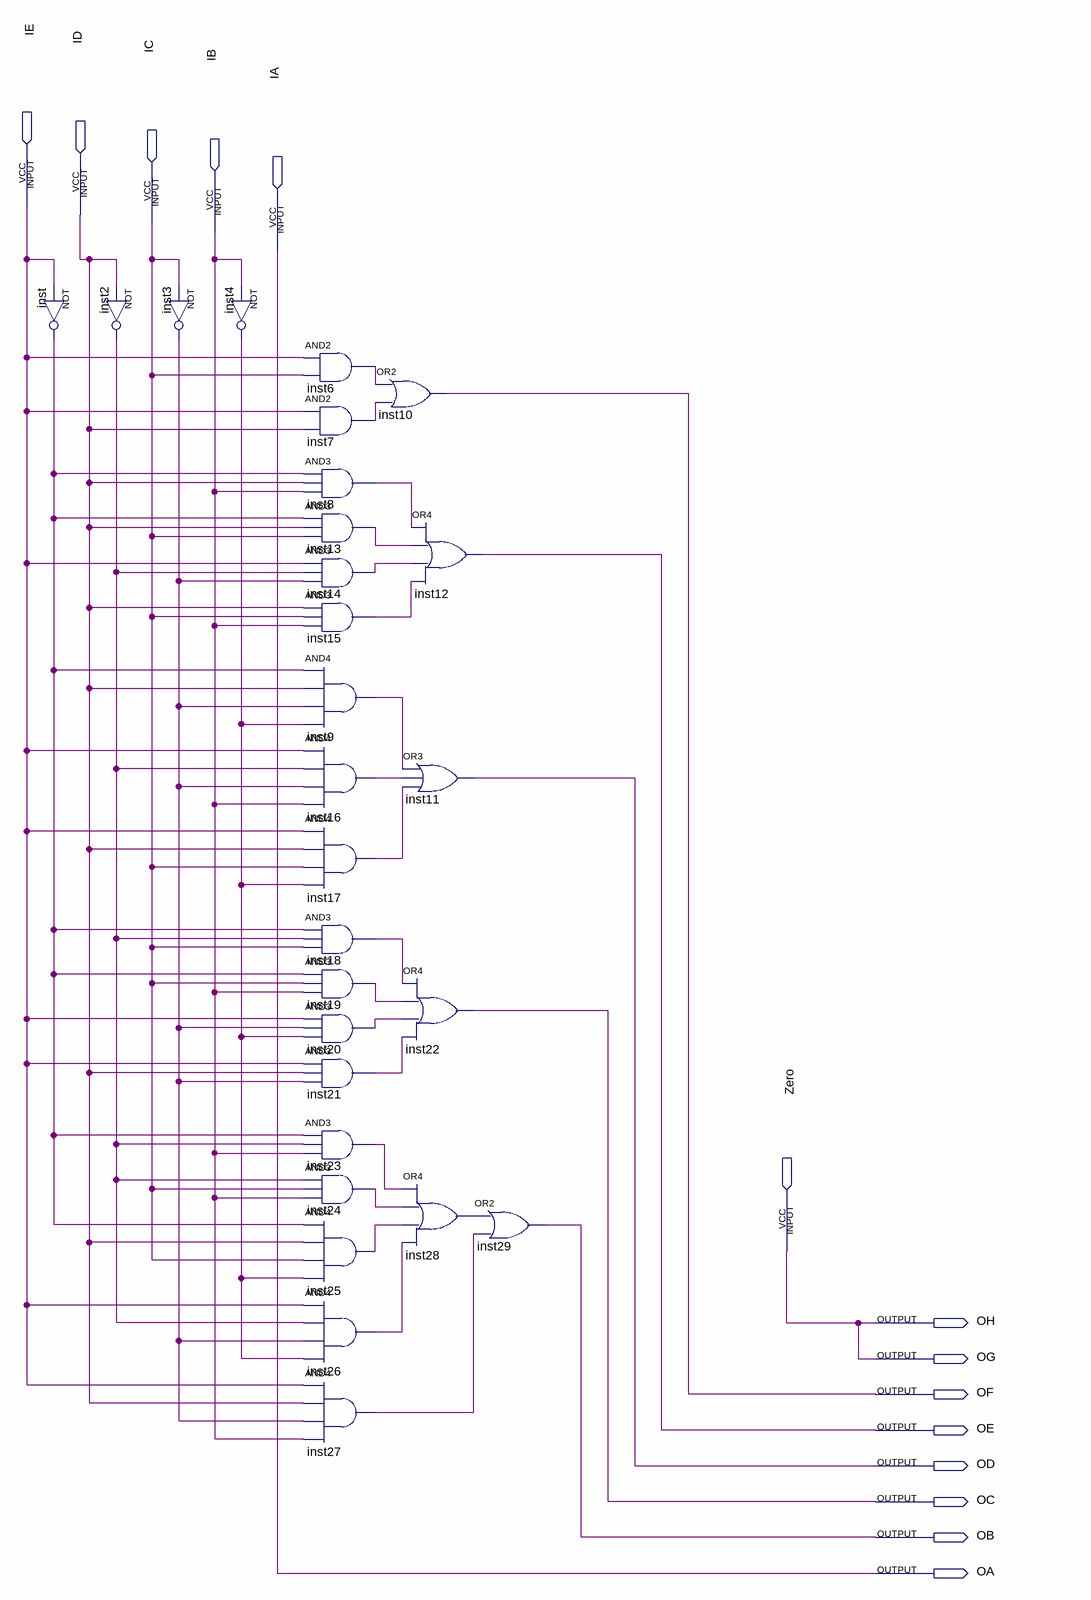
[diagram p0: schematic sheet]
// Quartus schematic hoon_segment_decorder_to_2_digits.bdf as structural Verilog: 28 symbols, 14 pins
module hoon_segment_decorder_to_2_digits (
  input  IE,
  input  ID,
  input  IC,
  input  IB,
  input  IA,
  input  Zero,
  output OH,
  output OG,
  output OF,
  output OE,
  output OD,
  output OC,
  output OB,
  output OA
);

  wire inst2_out, inst3_out, inst4_out, inst6_out, inst7_out, inst8_out, inst9_out, inst13_out, inst14_out,
       inst15_out, inst16_out, inst17_out, inst18_out, inst19_out, inst20_out, inst21_out, inst23_out,
       inst24_out, inst25_out, inst26_out, inst27_out, inst28_out, inst_out;

  not inst (inst_out, IE);
  not inst2 (inst2_out, ID);
  not inst3 (inst3_out, IC);
  not inst4 (inst4_out, IB);
  and inst6 (inst6_out, IE, IC);
  and inst7 (inst7_out, IE, ID);
  and inst8 (inst8_out, inst_out, ID, IB);
  and inst13 (inst13_out, inst_out, ID, IC);
  and inst14 (inst14_out, IE, inst2_out, inst3_out);
  and inst15 (inst15_out, ID, IC, IB);
  and inst9 (inst9_out, inst_out, ID, inst3_out, inst4_out);
  and inst16 (inst16_out, IE, inst2_out, inst3_out, IB);
  and inst17 (inst17_out, IE, ID, IC, inst4_out);
  and inst18 (inst18_out, inst_out, inst2_out, IC);
  and inst19 (inst19_out, inst_out, IC, IB);
  and inst20 (inst20_out, IE, inst3_out, inst4_out);
  and inst21 (inst21_out, IE, ID, inst3_out);
  and inst23 (inst23_out, inst_out, inst2_out, IB);
  and inst24 (inst24_out, inst2_out, IC, IB);
  and inst25 (inst25_out, inst_out, ID, IC, inst4_out);
  and inst26 (inst26_out, IE, inst2_out, inst3_out, inst4_out);
  and inst27 (inst27_out, IE, ID, inst3_out, IB);
  or inst10 (OF, inst6_out, inst7_out);
  or inst12 (OE, inst8_out, inst13_out, inst14_out, inst15_out);
  or inst11 (OD, inst9_out, inst16_out, inst17_out);
  or inst22 (OC, inst18_out, inst19_out, inst20_out, inst21_out);
  or inst28 (inst28_out, inst23_out, inst24_out, inst25_out, inst26_out);
  or inst29 (OB, inst28_out, inst27_out);

  assign OA = IA;
  assign OG = Zero;
  assign OH = Zero;
endmodule
